# EAGLE schematic Gadget-Box-teensy-modules (EAGLE 6.6.0)

## Sheet 1 of 2
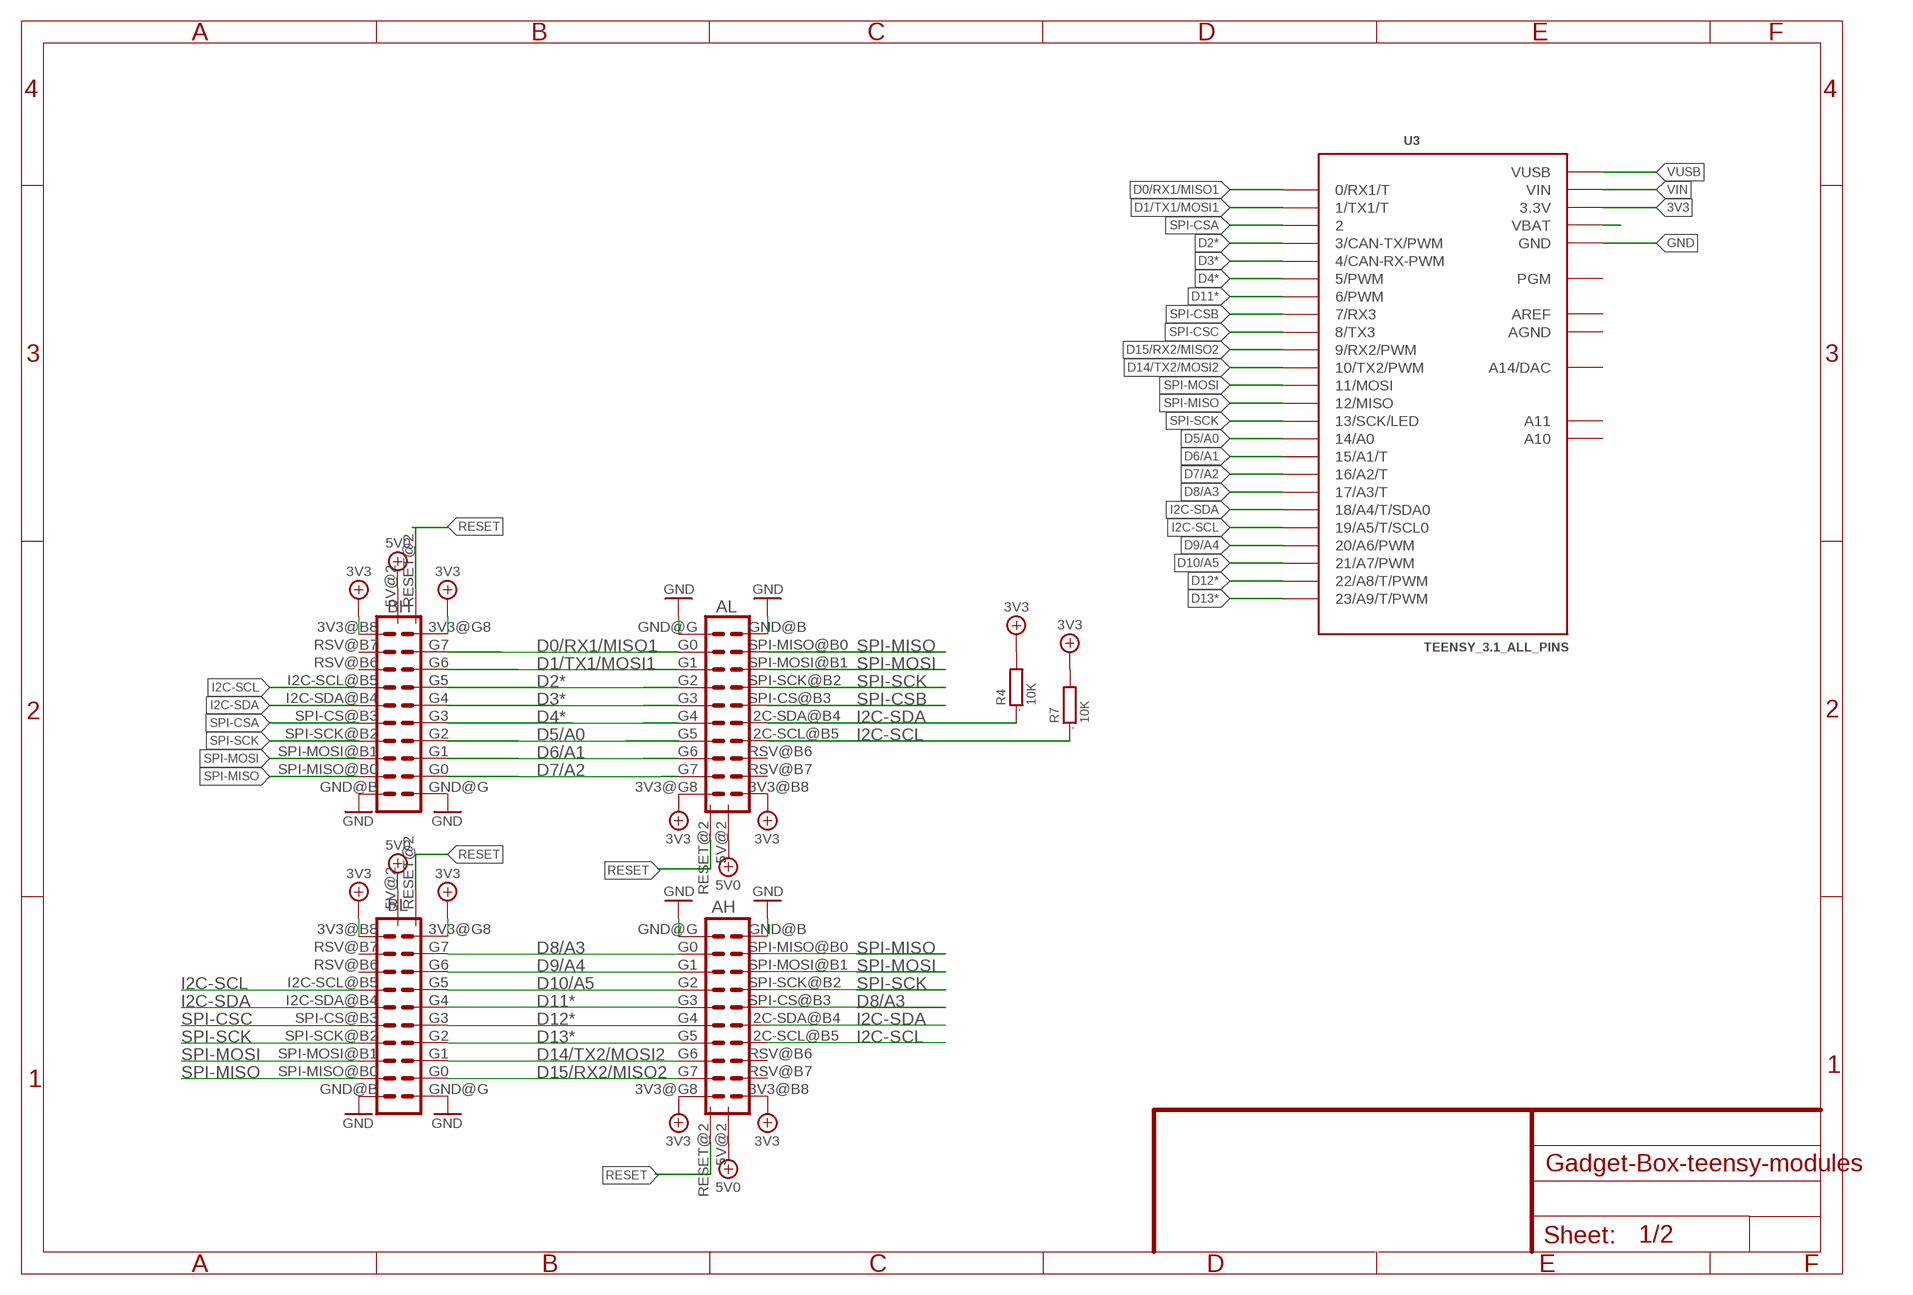
[diagram p0: schematic, sheet 1]

### Parts
AH  ECOGECOG_SLOT_ALT1  [ECOG_ALT1]
AL  ECOGECOG_SLOT_ALT1  [ECOG_ALT1]
BH  ECOGECOG_SLOT_ALT1  [ECOG_ALT1]
BL  ECOGECOG_SLOT_ALT1  [ECOG_ALT1]
R4  10K  R0603  [0603]
R7  10K  R0603  [0603]
U3  TEENSY_3.1_ALL_PINS  [TEENSY3-ALL_PINS]

### Nets
3V3: AH.3V3@B8(3V3) AH.3V3@G8(3V3) AL.3V3@B8(3V3) AL.3V3@G8(3V3) BH.3V3@B8(3V3) BH.3V3@G8(3V3) BL.3V3@B8(3V3) BL.3V3@G8(3V3) R4.2 R7.2 U3.3.3V U3.3.3V1(3.3V)
D0/RX1/MISO1: AL.G0 BH.G7 U3.0(0/RX1/T)
D1/TX1/MOSI1: AL.G1 BH.G6 U3.1(1/TX1/T)
D2*: AL.G2 BH.G5 U3.3(3/CAN-TX/PWM)
D3*: AL.G3 BH.G4 U3.4(4/CAN-RX-PWM)
D4*: AL.G4 BH.G3 U3.5(5/PWM)
D5/A0: AL.G5 BH.G2 U3.14/A0 ; also sheet 2
D6/A1: AL.G6 BH.G1 U3.15/A1(15/A1/T)
D7/A2: AL.G7 BH.G0 U3.16/A2(16/A2/T)
D8/A3: AH.G0 AH.SPI-CS@B3(SPI-CS) BL.G7 U3.17/A3(17/A3/T)
D9/A4: AH.G1 BL.G6 U3.20/A6(20/A6/PWM)
D10/A5: AH.G2 BL.G5 U3.21/A7(21/A7/PWM)
D11*: AH.G3 BL.G4 U3.6(6/PWM)
D12*: AH.G4 BL.G3 U3.22/A8(22/A8/T/PWM)
D13*: AH.G5 BL.G2 U3.23/A9(23/A9/T/PWM)
D14/TX2/MOSI2: AH.G6 BL.G1 U3.10(10/TX2/PWM)
D15/RX2/MISO2: AH.G7 BL.G0 U3.9(9/RX2/PWM)
GND [gnd]: AH.GND@B(GND) AH.GND@G(GND) AL.GND@B(GND) AL.GND@G(GND) BH.GND@B(GND) BH.GND@G(GND) BL.GND@B(GND) BL.GND@G(GND) U3.GND U3.GND1(GND) ; also sheet 2
I2C-SCL: AH.I2C-SCL@B5(I2C-SCL) AL.I2C-SCL@B5(I2C-SCL) BH.I2C-SCL@B5(I2C-SCL) BL.I2C-SCL@B5(I2C-SCL) R7.1 U3.19/A5(19/A5/T/SCL0)
I2C-SDA: AH.I2C-SDA@B4(I2C-SDA) AL.I2C-SDA@B4(I2C-SDA) BH.I2C-SDA@B4(I2C-SDA) BL.I2C-SDA@B4(I2C-SDA) R4.1 U3.18/A4(18/A4/T/SDA0)
RESET: AH.RESET@2(RESET) AL.RESET@2(RESET) BH.RESET@2(RESET) BL.RESET@2(RESET)
SPI-CSA: BH.SPI-CS@B3(SPI-CS) U3.2
SPI-CSB: AL.SPI-CS@B3(SPI-CS) U3.7(7/RX3)
SPI-CSC: BL.SPI-CS@B3(SPI-CS) U3.8(8/TX3)
SPI-MISO: AH.SPI-MISO@B0(SPI-MISO) AL.SPI-MISO@B0(SPI-MISO) BH.SPI-MISO@B0(SPI-MISO) BL.SPI-MISO@B0(SPI-MISO) U3.12(12/MISO)
SPI-MOSI: AH.SPI-MOSI@B1(SPI-MOSI) AL.SPI-MOSI@B1(SPI-MOSI) BH.SPI-MOSI@B1(SPI-MOSI) BL.SPI-MOSI@B1(SPI-MOSI) U3.11(11/MOSI)
SPI-SCK: AH.SPI-SCK@B2(SPI-SCK) AL.SPI-SCK@B2(SPI-SCK) BH.SPI-SCK@B2(SPI-SCK) BL.SPI-SCK@B2(SPI-SCK) U3.13(13/SCK/LED)
VBAT: U3.VBAT
VIN: U3.VIN ; also sheet 2
VUSB: AH.5V@2(5V) AL.5V@2(5V) BH.5V@2(5V) BL.5V@2(5V) U3.VUSB ; supply symbol labelled 5V0 ; also sheet 2
Unconnected: AH.RSV@B6(RSV) AH.RSV@B7(RSV) AL.RSV@B6(RSV) AL.RSV@B7(RSV) BH.RSV@B6(RSV) BH.RSV@B7(RSV) BL.RSV@B6(RSV) BL.RSV@B7(RSV) U3.A10 U3.A11 U3.PGM U3.RESET/DAC(A14/DAC)

## Sheet 2 of 2
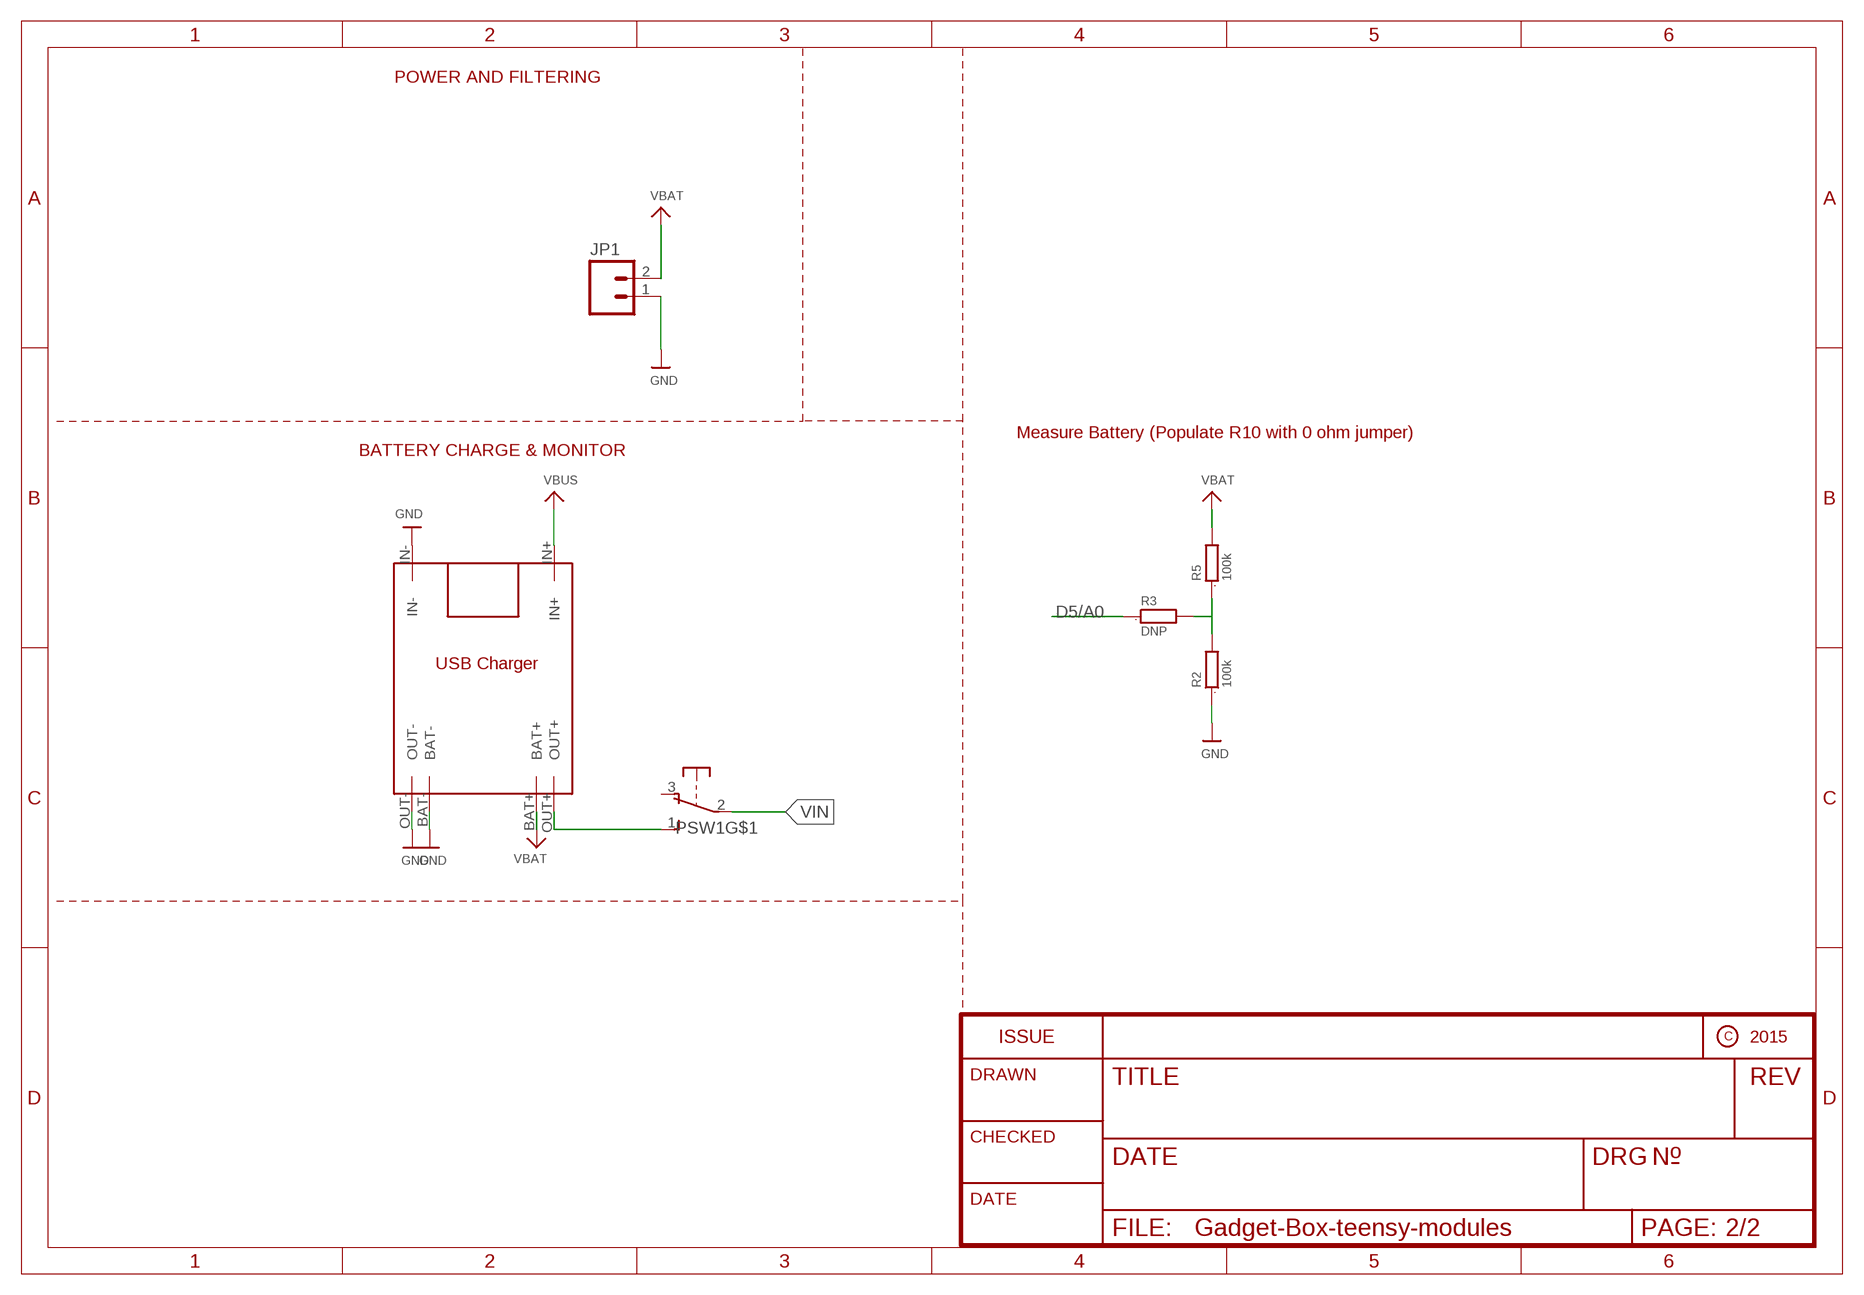
[diagram p1: schematic, sheet 2]

### Parts
JP1  M02-JST-2-PTH-NO_SILK  [JST-2-PTH-NS]
PSW1  OS102011MA1Q  [OS102011MA1Q]
R2  100k  R0603  [0603]
R3  DNP  R0603  [0603]
R5  100k  R0603  [0603]
U$1  TP4056  [TP4056]

### Nets
D5/A0: R3.1 ; also sheet 1
GND [gnd]: JP1.1 R2.1 U$1.BAT- U$1.IN- U$1.OUT- ; also sheet 1
N$2: R2.2 R3.2 R5.1
VBATTTERY: JP1.2 R5.2 U$1.BAT+ ; supply symbol labelled VBAT
VIN: PSW1.2(P) ; also sheet 1
VOUT: PSW1.1(S) U$1.OUT+
VUSB: U$1.IN+ ; supply symbol labelled VBUS ; also sheet 1
Unconnected: PSW1.3(O) PSW1.MT1(MT) PSW1.MT2(MT)

### Notes on the sheet
- POWER AND FILTERING
- Measure Battery (Populate R10 with 0 ohm jumper)
- BATTERY CHARGE & MONITOR

## Power pins joined to a net without a drawn wire
AGND: U3.AGND
AREF: U3.AREF

## Library data of the parts
AH AL BH BL = eCogs:ECOG; PARTNO: PPPC102LFBN-RC,SULLINS CONNECTOR SOLUTIONS,dk,S6106-ND,"CONN HEADER FEM 20POS.1"" DL GOLD", REF67
JP1 = SparkFun:M02: Header 2 Standard 2-pin 0.1" header. Use with straight break away headers (SKU : PRT-00116), right angle break away headers (PRT-00553), swiss pins (PRT-00743), machine pins (PRT-00117), and female headers (PRT-00115). Molex polarized connector foot print use with SKU : PRT-08233 with associated crimp pins and housings.; PARTNO: B2B-PH-SM4-TB(LF)(SN),JST SALES AMERICA INC (VA),dk,455-1734-1-ND ,"2 Positions Header, Shrouded Connector 0.079 (2.00mm) Through Hole Tin ", REF87
PSW1 = adafruit:OS102011MA1Q: OS10201MA1Q through-hole right angle switch http://www.ladyada.net/library/eagle; PARTNO: OS102011MA1QN1,C&K Components,dk,CKN9559-ND,SWITCH SLIDE SPDT 100MA 12V , REF72
R2 R5 = GadgetFactory:R: RESISTOR, European symbol; PARTNO: RC0603JR-07100KL,YAGEO (VA),dk,311-100KGRCT-ND,RES SMD 100K OHM 5% 1/10W 0603 , REF76
R3 = GadgetFactory:R: RESISTOR, European symbol; BOM: EXCLUDE
R4 R7 = GadgetFactory:R: RESISTOR, European symbol; PARTNO: RC0603JR-0710KL,YAGEO (VA),dk,311-10KGRCT-ND,RES SMD 10K OHM 5% 1/10W 0603 , REF36
U3 = Teensy_3_and_LC_Series_Boards_v1.1:TEENSY_3.1_ALL_PINS: Footprint for Teensy 3.1 or 3.2 board using all through-holes, i.e. the entire perimeter plus the 4 through-holes inboard (A10,A11,AREF, VUSB); BOM: EXCLUDE
U$1 = TP4056 charging module:TP4056

## Net classes
2 gnd: width 0.254 mm, drill 0.381 mm, clearance 0.254 mm
3 usbvcc: width 0.254 mm, drill 0.381 mm, clearance 0.254 mm
4 aref: width 0.254 mm, drill 0.381 mm, clearance 0.254 mm